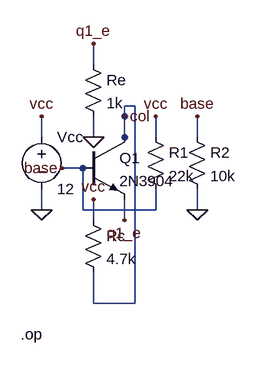
[diagram p0: schematic ce_bias.asc]
ce_bias.asc, the LTspice schematic file:
Version 4
SHEET 1 880 680
WIRE 128 80 128 48
WIRE 128 160 128 192
WIRE 304 80 304 48
WIRE 304 160 304 192
WIRE 304 192 192 192
WIRE 192 192 192 128
WIRE 192 128 160 128
WIRE 368 80 368 48
WIRE 368 160 368 192
WIRE 208 208 208 176
WIRE 208 288 208 336
WIRE 208 336 272 336
WIRE 272 336 272 32
WIRE 272 32 256 32
WIRE 256 32 256 80
WIRE 256 80 256 48
WIRE 256 176 256 208
WIRE 208 -32 208 -64
WIRE 208 48 208 80
FLAG 128 48 vcc
FLAG 128 192 0
FLAG 304 48 vcc
FLAG 160 128 base
FLAG 368 48 base
FLAG 368 192 0
FLAG 208 176 vcc
FLAG 256 48 col
FLAG 256 208 q1_e
FLAG 208 -64 q1_e
FLAG 208 80 0
SYMBOL voltage 128 64 R0
SYMATTR InstName Vcc
SYMATTR Value 12
SYMBOL npn 192 80 R0
SYMATTR InstName Q1
SYMATTR Value 2N3904
SYMBOL res 288 64 R0
SYMATTR InstName R1
SYMATTR Value 22k
SYMBOL res 352 64 R0
SYMATTR InstName R2
SYMATTR Value 10k
SYMBOL res 192 192 R0
SYMATTR InstName Rc
SYMATTR Value 4.7k
SYMBOL res 192 -48 R0
SYMATTR InstName Re
SYMATTR Value 1k
TEXT 96 384 Left 2 !.op

The netlist it stands for:
* ce_bias.asc
Vcc vcc 0 12
Q1 col base q1_e 0 2N3904
R1 vcc base 22k
R2 base 0 10k
Rc vcc col 4.7k
Re q1_e 0 1k
.model NPN NPN
.model PNP PNP
.lib standard.bjt
.op
.backanno
.end